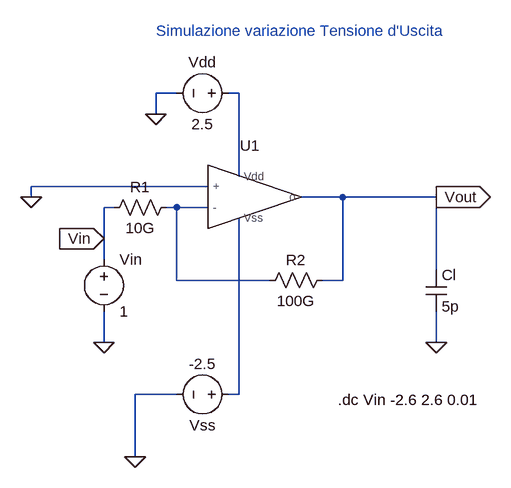
[diagram p0: schematic Vout_Basic.asc]
Vout_Basic.asc, the LTspice schematic file:
Version 4
SHEET 1 880 680
WIRE 0 -48 -32 -48
WIRE 96 -48 80 -48
WIRE -32 -16 -32 -48
WIRE 96 80 96 -48
WIRE 48 96 -224 96
WIRE -224 112 -224 96
WIRE 256 112 192 112
WIRE 400 112 256 112
WIRE -96 128 -112 128
WIRE 0 128 -16 128
WIRE 48 128 0 128
WIRE -112 176 -112 128
WIRE -112 208 -112 176
WIRE 400 224 400 112
WIRE 0 240 0 128
WIRE 144 240 0 240
WIRE 256 240 256 112
WIRE 256 240 224 240
WIRE -112 336 -112 288
WIRE 400 336 400 288
WIRE 0 416 -64 416
WIRE 96 416 96 144
WIRE 96 416 80 416
WIRE -64 512 -64 416
FLAG 400 336 0
FLAG -112 336 0
FLAG -32 -16 0
FLAG -64 512 0
FLAG -112 176 Vin
IOPIN -112 176 In
FLAG 400 112 Vout
IOPIN 400 112 Out
FLAG -224 112 0
SYMBOL AutoGenerated\\OPAMPBASIC 112 112 R0
WINDOW 3 81 72 Invisible 2
SYMATTR InstName U1
SYMBOL cap 384 224 R0
SYMATTR InstName Cl
SYMATTR Value 5p
SYMBOL voltage -112 192 R0
WINDOW 123 0 0 Left 0
WINDOW 39 0 0 Left 0
SYMATTR InstName Vin
SYMATTR Value 1
SYMBOL voltage 96 -48 R90
WINDOW 0 -32 56 VBottom 2
WINDOW 3 32 56 VTop 2
SYMATTR InstName Vdd
SYMATTR Value 2.5
SYMBOL voltage 96 416 R90
WINDOW 0 32 56 VTop 2
WINDOW 3 -32 56 VBottom 2
WINDOW 123 0 0 Left 0
WINDOW 39 0 0 Left 0
SYMATTR InstName Vss
SYMATTR Value -2.5
SYMBOL res 0 112 R90
WINDOW 0 0 56 VBottom 2
WINDOW 3 32 56 VTop 2
SYMATTR InstName R1
SYMATTR Value 10G
SYMBOL res 240 224 R90
WINDOW 0 0 56 VBottom 2
WINDOW 3 32 56 VTop 2
SYMATTR InstName R2
SYMATTR Value 100G
TEXT -32 -144 Left 2 ;Simulazione variazione Tensione d'Uscita
TEXT 248 424 Left 2 !.dc Vin -2.6 2.6 0.01

The netlist it stands for:
* Vout_Basic.asc
XU1 0 N002 Vout N001 N003 OPAMPBASIC  ; pins + - o Vdd Vss
Cl Vout 0 5p
Vin Vin 0 1
Vdd N001 0 2.5
Vss N003 0 -2.5
R1 N002 Vin 10G
R2 Vout N002 100G
* Simulazione variazione Tensione d'Uscita
.dc Vin -2.6 2.6 0.01
.lib C:\Users\andre\Desktop\Universita\PrimoAnno\SecondoSemestre\ProgettiAnalogici\OpAmpProject\Basic\OpAmpBasic.cir
.backanno
.end